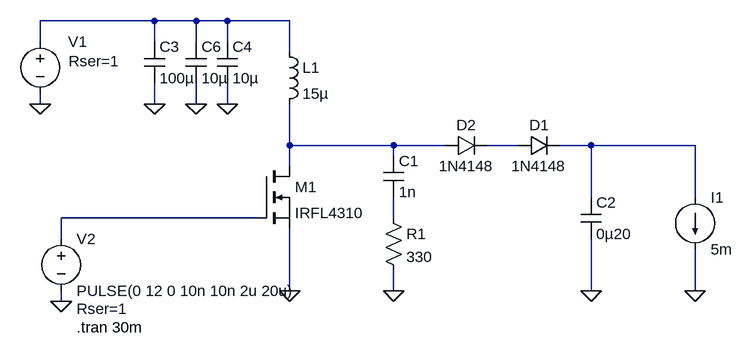
[diagram p0: schematic stepup.asc]
stepup.asc, the LTspice schematic file:
Version 4
SHEET 1 1108 680
WIRE 96 32 -80 32
WIRE 160 32 96 32
WIRE 208 32 160 32
WIRE 304 32 208 32
WIRE -80 64 -80 32
WIRE 96 64 96 32
WIRE 160 64 160 32
WIRE 208 64 208 32
WIRE 304 80 304 32
WIRE -80 160 -80 144
WIRE 96 160 96 128
WIRE 160 160 160 128
WIRE 208 160 208 128
WIRE 304 224 304 160
WIRE 464 224 304 224
WIRE 544 224 464 224
WIRE 656 224 608 224
WIRE 768 224 720 224
WIRE 928 224 768 224
WIRE 464 240 464 224
WIRE 304 256 304 224
WIRE 768 304 768 224
WIRE 928 304 928 224
WIRE 256 336 -48 336
WIRE 464 336 464 304
WIRE -48 368 -48 336
WIRE 304 448 304 352
WIRE 464 448 464 416
WIRE 768 448 768 368
WIRE 928 448 928 384
WIRE -48 464 -48 448
FLAG -80 160 0
FLAG 304 448 0
FLAG -48 464 0
FLAG 464 448 0
FLAG 768 448 0
FLAG 928 448 0
FLAG 96 160 0
FLAG 208 160 0
FLAG 160 160 0
SYMBOL voltage -80 48 R0
WINDOW 3 24 96 Invisible 2
WINDOW 123 0 0 Left 2
WINDOW 39 44 46 Left 2
WINDOW 0 43 16 Left 2
SYMATTR Value 12
SYMATTR SpiceLine Rser=1
SYMATTR InstName V1
SYMBOL ind 288 64 R0
SYMATTR InstName L1
SYMATTR Value 15µ
SYMATTR SpiceLine Rser=0.096
SYMBOL nmos 256 256 R0
SYMATTR InstName M1
SYMATTR Value IRFL4310
SYMBOL voltage -48 352 R0
WINDOW 123 0 0 Left 2
WINDOW 39 24 124 Left 2
SYMATTR SpiceLine Rser=1
SYMATTR InstName V2
SYMATTR Value PULSE(0 12 0 10n 10n 2u 20u)
SYMBOL cap 448 240 R0
SYMATTR InstName C1
SYMATTR Value 1n
SYMBOL res 448 320 R0
SYMATTR InstName R1
SYMATTR Value 330
SYMBOL diode 656 240 R270
WINDOW 0 32 32 VTop 2
WINDOW 3 0 32 VBottom 2
SYMATTR InstName D1
SYMATTR Value 1N4148
SYMBOL cap 752 304 R0
SYMATTR InstName C2
SYMATTR Value 0µ20
SYMBOL current 928 304 R0
WINDOW 123 0 0 Left 2
WINDOW 39 0 0 Left 2
SYMATTR InstName I1
SYMATTR Value 5m
SYMBOL cap 80 64 R0
SYMATTR InstName C3
SYMATTR Value 100µ
SYMATTR SpiceLine Rser=0.36
SYMBOL cap 192 64 R0
SYMATTR InstName C4
SYMATTR Value 10µ
SYMATTR SpiceLine Rser=0.1
SYMBOL cap 144 64 R0
SYMATTR InstName C6
SYMATTR Value 10µ
SYMATTR SpiceLine Rser=0.1
SYMBOL diode 544 240 R270
WINDOW 0 32 32 VTop 2
WINDOW 3 0 32 VBottom 2
SYMATTR InstName D2
SYMATTR Value 1N4148
TEXT -24 504 Left 2 !.tran 30m

The netlist it stands for:
* stepup.asc
V1 N001 0 12 Rser=1
L1 N001 N002 15µ Rser=0.096
M1 N002 N005 0 0 IRFL4310
V2 N005 0 PULSE(0 12 0 10n 10n 2u 20u) Rser=1
C1 N002 N006 1n
R1 N006 0 330
D1 N003 N004 1N4148
C2 N004 0 0µ20
I1 N004 0 5m
C3 N001 0 100µ Rser=0.36
C4 N001 0 10µ Rser=0.1
C6 N001 0 10µ Rser=0.1
D2 N002 N003 1N4148
.model D D
.lib standard.dio
.model NMOS NMOS
.model PMOS PMOS
.lib standard.mos
.tran 30m
.backanno
.end